# Altium schematic sheet Fuente.SchDoc
size A4
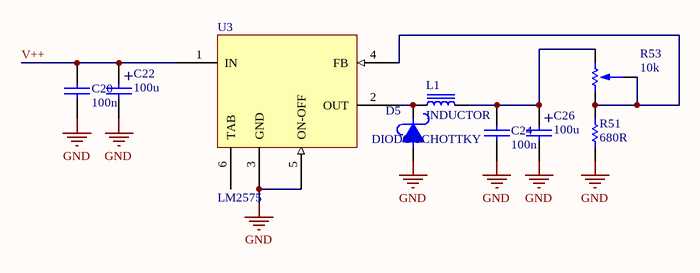
[diagram p0: Fuente.SchDoc]

## Parts
C20  100n  [CAP200]
C22  100u  [CAP200RP2]
C24  100n  [CAP200]
C26  100u  [CAP200RP2]
D5  DIODO SCHOTTKY  [DO41]
L1  INDUCTOR  [L_IHLP]
R51  680R  [1206]
R53  10k  [PRESET V]
U3  LM2575  [TO263]

## Nets
GND: C20.1 C22.2 C24.1 C26.2 D5.1 R51.2 U3.3(GND) U3.5(ON-OFF)
V++: C20.2 C22.1 U3.1(IN)
NetC24_2: C24.2 C26.1 L1.2 R53.1
NetD5_2: D5.2 L1.1 U3.2(OUT)
NetR51_1: R51.1 R53.2 R53.3 U3.4(FB)

Not connected (* = marked no-connect by the designer): U3 6(TAB)

## Notes on the sheet
- (in symbol CAPPOL) +

## Library data of the parts
C20 C24 = CAP
C22 C26 = CAPPOL
R51 = RES: RES SMD 1/2W 1206
R53 = PRESET